# EAGLE schematic DisplayBoard (EAGLE 7.1.0)
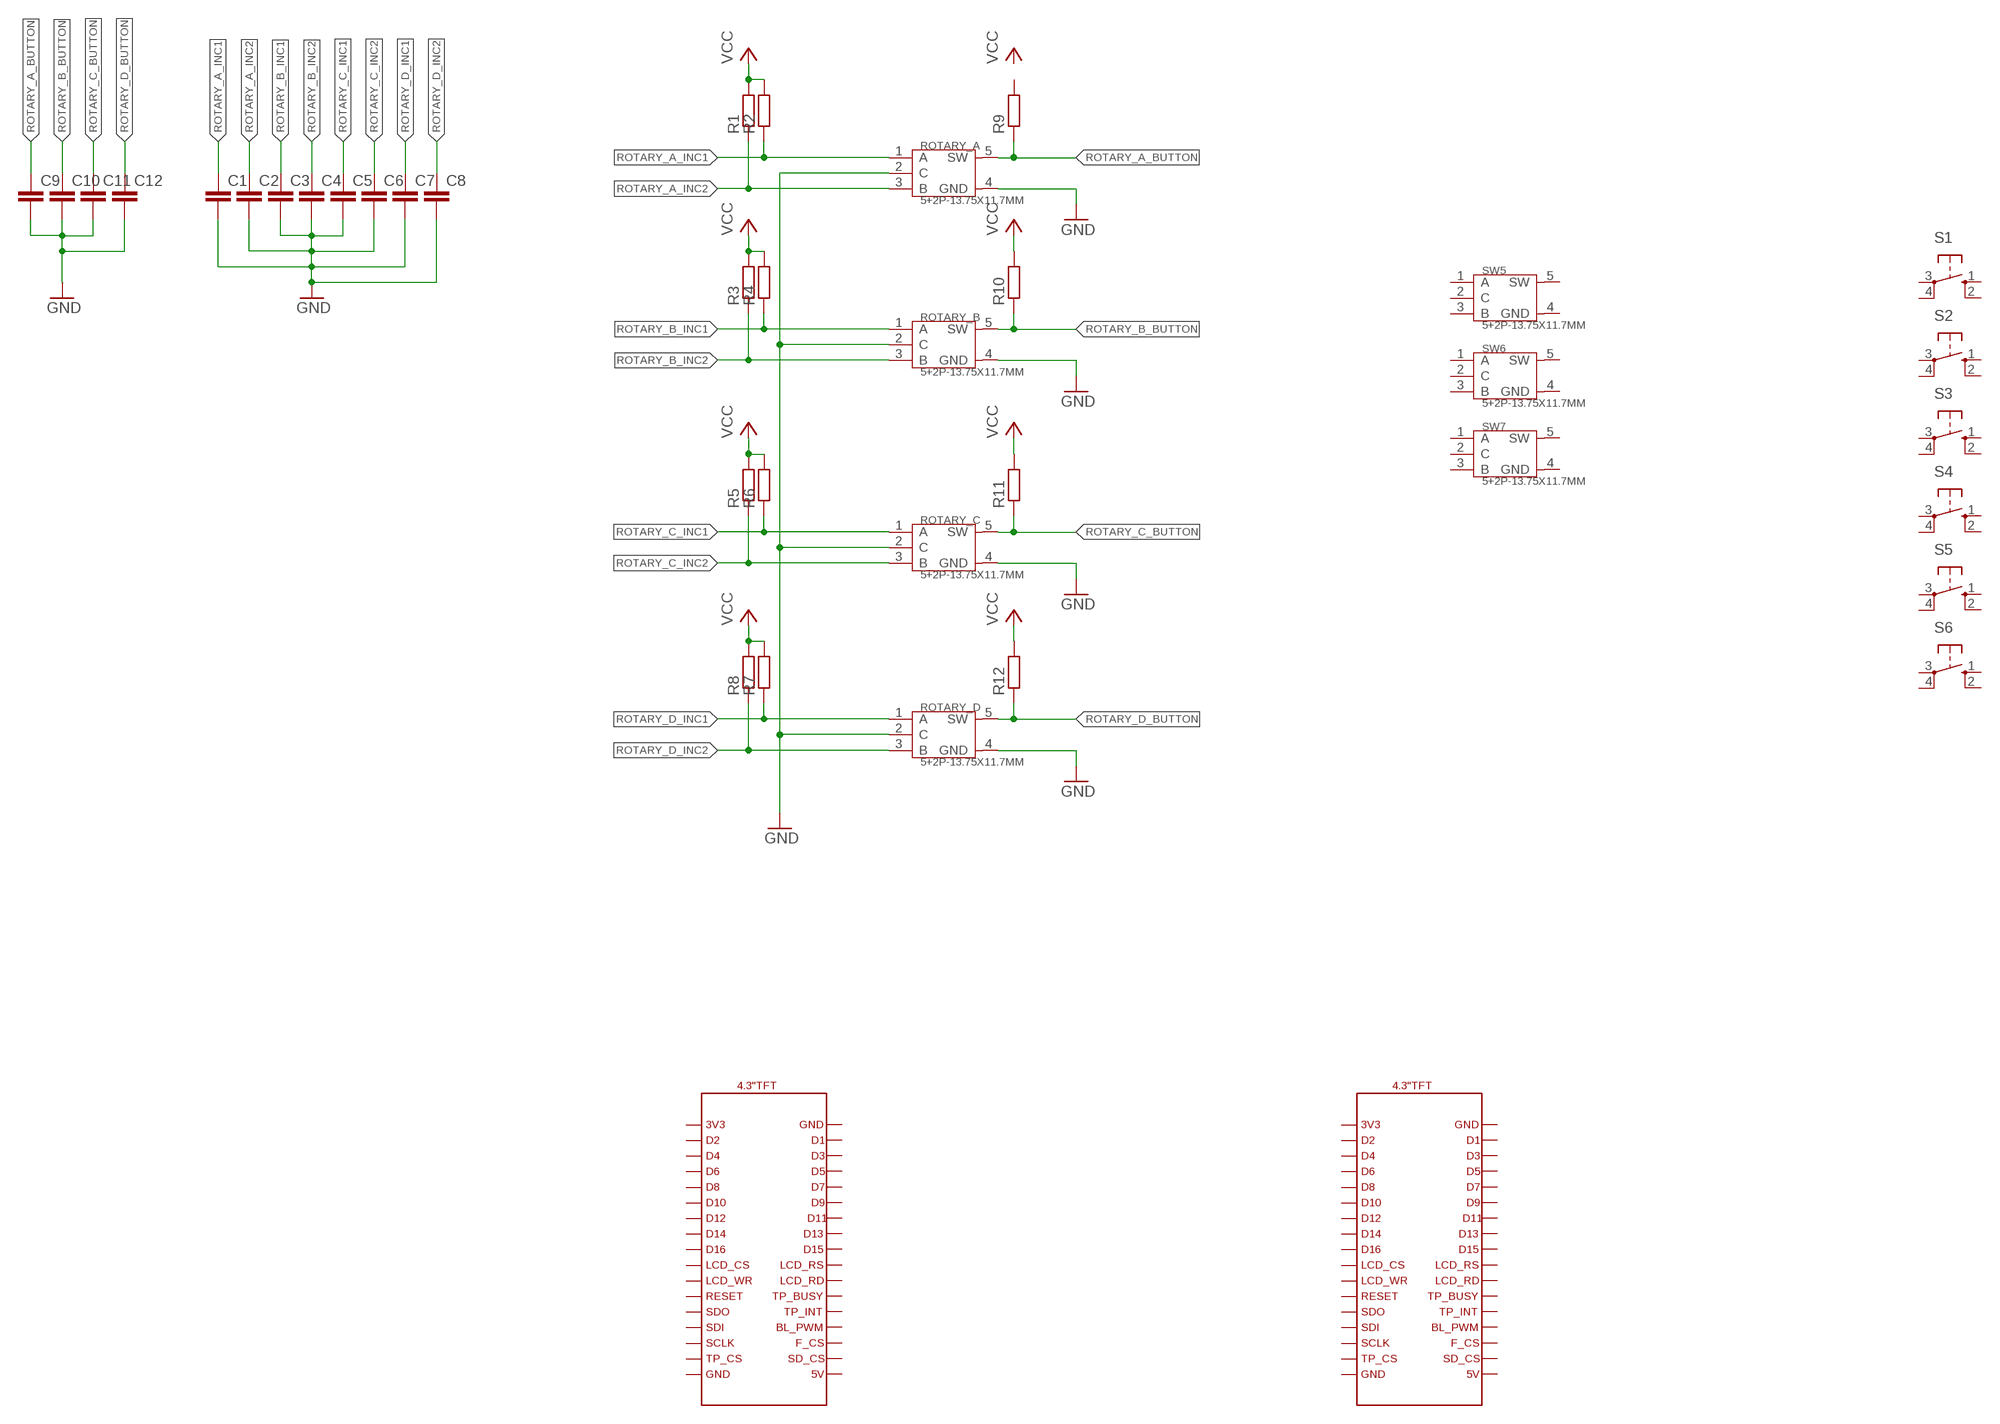
[diagram p0: schematic, sheet 1]

## Parts
C1  C-EUC0805  [C0805]
C2  C-EUC0805  [C0805]
C3  C-EUC0805  [C0805]
C4  C-EUC0805  [C0805]
C5  C-EUC0805  [C0805]
C6  C-EUC0805  [C0805]
C7  C-EUC0805  [C0805]
C8  C-EUC0805  [C0805]
C9  C-EUC0805  [C0805]
C10  C-EUC0805  [C0805]
C11  C-EUC0805  [C0805]
C12  C-EUC0805  [C0805]
R1  R-EU_R0805  [R0805]
R2  R-EU_R0805  [R0805]
R3  R-EU_R0805  [R0805]
R4  R-EU_R0805  [R0805]
R5  R-EU_R0805  [R0805]
R6  R-EU_R0805  [R0805]
R7  R-EU_R0805  [R0805]
R8  R-EU_R0805  [R0805]
R9  R-EU_R0805  [R0805]
R10  R-EU_R0805  [R0805]
R11  R-EU_R0805  [R0805]
R12  R-EU_R0805  [R0805]
ROTARY_A  5+2P-13.75X11.7MM  DIP-ROTARY-SWITCH(5+2P-13.75X11.7MM)  [SW7-13.75X11.7X6.5MM]
ROTARY_B  5+2P-13.75X11.7MM  DIP-ROTARY-SWITCH(5+2P-13.75X11.7MM)  [SW7-13.75X11.7X6.5MM]
ROTARY_C  5+2P-13.75X11.7MM  DIP-ROTARY-SWITCH(5+2P-13.75X11.7MM)  [SW7-13.75X11.7X6.5MM]
ROTARY_D  5+2P-13.75X11.7MM  DIP-ROTARY-SWITCH(5+2P-13.75X11.7MM)  [SW7-13.75X11.7X6.5MM]
S1  10-XX  [B3F-10XX]
S2  10-XX  [B3F-10XX]
S3  10-XX  [B3F-10XX]
S4  10-XX  [B3F-10XX]
S5  10-XX  [B3F-10XX]
S6  10-XX  [B3F-10XX]
SW5  5+2P-13.75X11.7MM  DIP-ROTARY-SWITCH(5+2P-13.75X11.7MM)  [SW7-13.75X11.7X6.5MM]
SW6  5+2P-13.75X11.7MM  DIP-ROTARY-SWITCH(5+2P-13.75X11.7MM)  [SW7-13.75X11.7X6.5MM]
SW7  5+2P-13.75X11.7MM  DIP-ROTARY-SWITCH(5+2P-13.75X11.7MM)  [SW7-13.75X11.7X6.5MM]
U$1  4.3"TFT  [4.3TFT]

## Nets
GND: C1.2 C2.2 C3.2 C4.2 C5.2 C6.2 C7.2 C8.2 C9.2 C10.2 C11.2 C12.2 ROTARY_A.2(C) ROTARY_A.4(GND) ROTARY_B.2(C) ROTARY_B.4(GND) ROTARY_C.2(C) ROTARY_C.4(GND) ROTARY_D.2(C) ROTARY_D.4(GND)
ROTARY_A_BUTTON: C9.1 R9.1 ROTARY_A.5(SW)
ROTARY_A_INC1: C1.1 R2.1 ROTARY_A.1(A)
ROTARY_A_INC2: C2.1 R1.1 ROTARY_A.3(B)
ROTARY_B_BUTTON: C10.1 R10.1 ROTARY_B.5(SW)
ROTARY_B_INC1: C3.1 R4.1 ROTARY_B.1(A)
ROTARY_B_INC2: C4.1 R3.1 ROTARY_B.3(B)
ROTARY_C_BUTTON: C11.1 R11.1 ROTARY_C.5(SW)
ROTARY_C_INC1: C5.1 R6.1 ROTARY_C.1(A)
ROTARY_C_INC2: C6.1 R5.1 ROTARY_C.3(B)
ROTARY_D_BUTTON: C12.1 R12.1 ROTARY_D.5(SW)
ROTARY_D_INC1: C7.1 R7.1 ROTARY_D.1(A)
ROTARY_D_INC2: C8.1 R8.1 ROTARY_D.3(B)
VCC: R1.2 R2.2 R3.2 R4.2 R5.2 R6.2 R7.2 R8.2 R10.2 R11.2 R12.2
Unconnected: R9.2 S1.1(S) S1.2(S1) S1.3(P) S1.4(P1) S2.1(S) S2.2(S1) S2.3(P) S2.4(P1) S3.1(S) S3.2(S1) S3.3(P) S3.4(P1) S4.1(S) S4.2(S1) S4.3(P) S4.4(P1) S5.1(S) S5.2(S1) S5.3(P) S5.4(P1) S6.1(S) S6.2(S1) S6.3(P) S6.4(P1) SW5.1(A) SW5.2(C) SW5.3(B) SW5.4(GND) SW5.5(SW) SW6.1(A) SW6.2(C) SW6.3(B) SW6.4(GND) SW6.5(SW) SW7.1(A) SW7.2(C) SW7.3(B) SW7.4(GND) SW7.5(SW) U$1.JP1_1 U$1.JP1_2 U$1.JP1_3 U$1.JP1_4 U$1.JP1_5 U$1.JP1_6 U$1.JP1_7 U$1.JP1_8 U$1.JP1_9 U$1.JP1_10 U$1.JP1_11 U$1.JP1_12 U$1.JP1_13 U$1.JP1_14 U$1.JP1_15 U$1.JP1_16 U$1.JP1_17 U$1.JP1_18 U$1.JP1_19 U$1.JP1_20 U$1.JP1_21 U$1.JP1_22 U$1.JP1_23 U$1.JP1_24 U$1.JP1_25 U$1.JP1_26 U$1.JP1_27 U$1.JP1_28 U$1.JP1_29 U$1.JP1_30 U$1.JP1_31 U$1.JP1_32 U$1.JP1_33 U$1.JP1_34 U$1.JP2_1 U$1.JP2_2 U$1.JP2_3 U$1.JP2_4 U$1.JP2_5 U$1.JP2_6 U$1.JP2_7 U$1.JP2_8 U$1.JP2_9 U$1.JP2_10 U$1.JP2_11 U$1.JP2_12 U$1.JP2_13 U$1.JP2_14 U$1.JP2_15 U$1.JP2_16 U$1.JP2_17 U$1.JP2_18 U$1.JP2_19 U$1.JP2_20 U$1.JP2_21 U$1.JP2_22 U$1.JP2_23 U$1.JP2_24 U$1.JP2_25 U$1.JP2_26 U$1.JP2_27 U$1.JP2_28 U$1.JP2_29 U$1.JP2_30 U$1.JP2_31 U$1.JP2_32 U$1.JP2_33 U$1.JP2_34

## Library data of the parts
C1-C12 = rcl:C-EU: CAPACITOR, European symbol
R1-R12 = rcl:R-EU_: RESISTOR, European symbol
ROTARY_A ROTARY_B ROTARY_C ROTARY_D SW5-SW7 = Seeed-OPL-Switch:DIP-ROTARY-SWITCH(5+2P-13.75X11.7MM): 311130001; MPN: Rotary-switch
S1-S6 = switch-omron:10-XX: OMRON SWITCH; MPN: B3F-1000; OC_FARNELL: 176432; OC_NEWARK: 36M3542
U$1 = Displays:4.3"TFT: 4.3 inch TFT LCD 480x272 Pix with resistiv touch panel